# Altium schematic sheet v1.0.SchDoc
size 134 x 78 mm
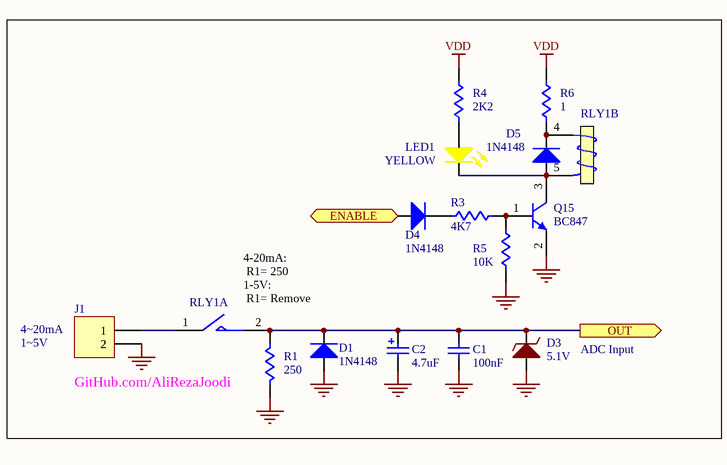
[diagram p0: v1.0.SchDoc]

## Parts
C1  100nF  [CAPNTO2.54-3.05x1.78A]
C2  4.7uF  [CAPPR2.5-6.3x5]
D1  1N4148  [D_THD_AXIAL0.4_DO-41]
D3  5.1V  [D_THD_AXIAL0.3_DO-35]
D4  value 1N4148  [0805_Diode]  (hidden comment: Diode)
D5  value 1N4148  [0805_Diode]  (hidden comment: Diode)
J1  Header 2  [Fonics_2PIN_1]  (value not drawn)
LED1  YELLOW  [LED_THD_3MM_YELLOW_R]
Q1  Q15  value BC847  [SOT23-3N]
R1  250  [AXIAL-0.4]
R3  value 4K7  [0805]  (hidden comment: Res1)
R4  value 2K2  [0805]  (hidden comment: Res1)
R5  value 10K  [0805]  (hidden comment: Res1)
R6  1  [RESC3216N]
RLY1  RELAU  [RELAY-SPDT-2]  (value not drawn)  (parts A,B of 2)

## Ports
ENABLE (in), OUT (out)

## Nets
GND: C1.1 C2.2 D1.1(A) D3.1 J1.2 Q1.2(E) R1.2 R5.1
VDD: R4.1 R6.1
ENABLE: D4.1(A) ; port ENABLE
OUT: C1.2 C2.1 D1.2(K) D3.2 R1.1 RLY1.2(NO) ; port OUT
NetD4_2: D4.2(K) R3.1
NetD5_1: D5.1(A) LED1.2(K) Q1.3(C) RLY1.5(T2)
NetD5_2: D5.2(K) R6.2 RLY1.4(T1)
NetJ1_1: J1.1 RLY1.1(COM)
NetLED1_1: LED1.1(A) R4.2
NetQ1_1: Q1.1(B) R3.2 R5.2

## Notes on the sheet
- 4~20mA
- 4-20mA:
  R1= 250
  1-5V:
  R1= Remove
- 1~5V
- GitHub.com/AliRezaJoodi
- ADC Input

## Library data of the parts
C1 = Cap: Capacitor; Manufacturer: Generic Components; Class I: Passive; Published: 8-Jun-2000; Revision: July-2002: Re-released for DXP Platform.; Publisher: Altium Limited; Class II: Capacitor
C2 = Cap Pol1: Polarized Capacitor (Radial); Manufacturer: Generic Components; Class I: Passive; Published: 8-Jun-2000; Revision: July-2002: Re-released for DXP Platform.; Publisher: Altium Limited; Class II: Capacitor
D1 = Diode: Diode,; Revision: July-2002: Re-released for DXP Platform.
D3 = Diode_Zener: Diode, Zener; Revision: July-2002: Re-released for DXP Platform.
D4 D5 = Diode: Default Diode; Manufacturer: Generic Components; Class I: Discrete; Class II: Diode - Switching; Published: 8-Jun-2000; Revision: July-2002: Re-released for DXP Platform.; Publisher: Altium Limited
J1 = Header 2: Header, 2-Pin; LatestRevisionDate: 17-Jul-2002; LatestRevisionNote: Re-released for DXP Platform.; Publisher: Altium Limited
LED1 = LED_YELLOW: LED, Yellow; Manufacturer: Generic Components; Class I: Optoelectronic; Published: 8-Jun-2000; Revision: July-2002: Re-released for DXP Platform.; Publisher: Altium Limited; Class II: LED
Q1 = BC847: Silicon Bipolar Transistor
R1 R3-R6 = Res1: Resistor; Manufacturer: Generic Components; Class I: Passive; Published: 8-Jun-2000; Revision: July-2002: Re-released for DXP Platform.; Publisher: Altium Limited; Class II: Resistor
RLY1 = RELAY-NY12W-K: Value: LM358; Published: 17-Jul-2002; LatestRevisionDate: 13-Apr-2006; LatestRevisionNote: IPC-7351 Footprint Added.; DatasheetVersion: 1988; PackageReference: 751-02; Publisher: Altium Limited; PackageDescription: 8-Pin Small Outline Integrated Circuit 1.27 mm Pitch; Code_JEDEC: MS-012-AA; Code_IPC: SOIC127P600-8; ComponentLink1Description: Manufacturer Link; ComponentLink1URL: http://www.onsemi.com/site/products/parametrics/0,4446,251,00.html; ComponentLink2Description: Datasheet; ComponentLink2URL: http://www.onsemi.com/pub/Collateral/LM358-D.PDF